# Altium schematic sheet AMC_Connector.SchDoc: AMC FMC Carrier v4.0.5
size 420 x 297 mm; DocumentNumber: 1; Revision: 1; SheetNumber: 2; SheetTotal: 29; Organization: ISE; Address1: Warsaw University of Technology; Address2: Nowowiejska 15/19 00-665 Warsaw; Address3: t.przywozki@gmail.com; ModifiedBy: F. Świtakowski; CheckedDate: -; Title2: AMC connector; DivGrp: ISE; Designer: T.Przywozki; Project: AMC FMC Carrier v4.0.5
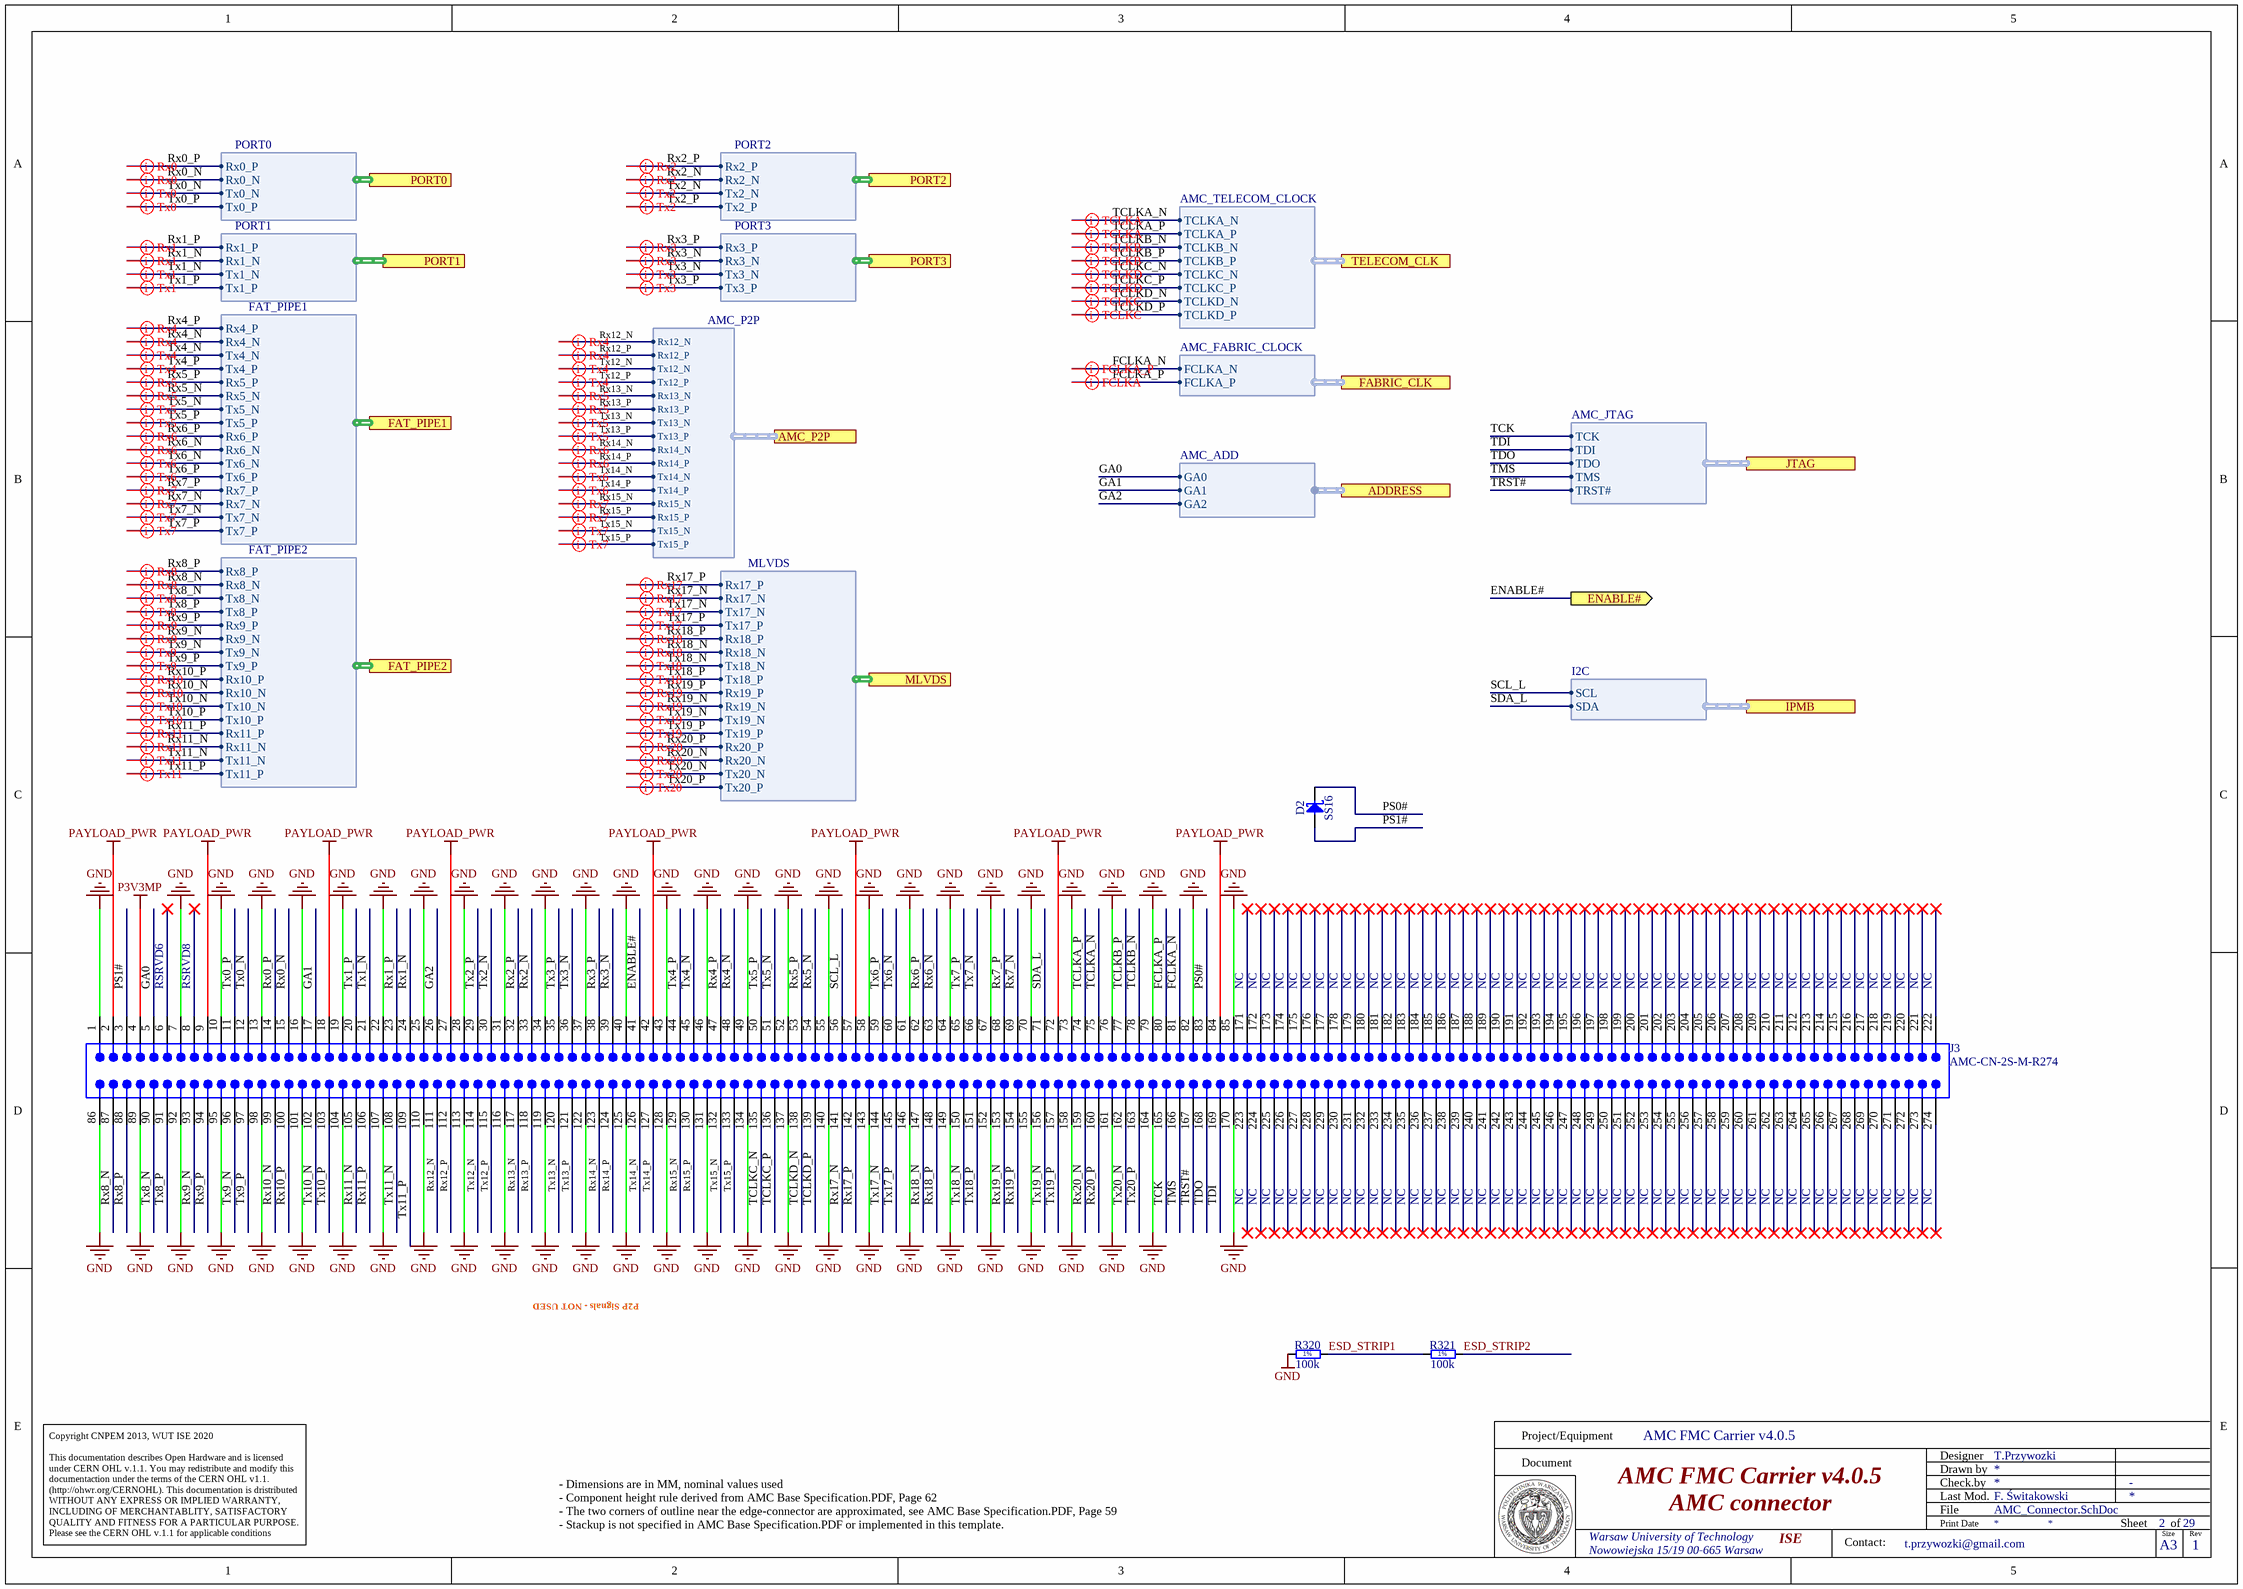
[diagram p0: AMC_Connector.SchDoc]

## Parts
D2  SS16  [DIOM5127X229N]
J3  AMC-CN-2S-M-R274  [AMC-GF-2D-750-O274]  (no BOM)
R320  100k  [RESC3216X65N]
R321  100k  [RESC3216X65N]

## Ports
ADDRESS (harness AMC_ADD), AMC_P2P (harness AMC_P2P), ENABLE# (out), FABRIC_CLK (harness AMC_FABRIC_CLOCK), FAT_PIPE1 (harness FAT_PIPE1), FAT_PIPE2 (harness FAT_PIPE2), IPMB (harness I2C), JTAG (harness AMC_JTAG), MLVDS (harness MLVDS), PORT0 (harness PORT0), PORT1 (harness PORT1), PORT2 (harness PORT2), PORT3 (harness PORT3), TELECOM_CLK (harness AMC_TELECOM_CLOCK)

## Harnesses
AMC_JTAG: TCK, TDI, TDO, TMS, TRST#
AMC_TELECOM_CLOCK: TCLKA_N, TCLKA_P, TCLKB_N, TCLKB_P, TCLKC_N, TCLKC_P, TCLKD_N, TCLKD_P
AMC_FABRIC_CLOCK: FCLKA_N, FCLKA_P
I2C: SCL, SDA
PORT0: Rx0_P, Rx0_N, Tx0_N, Tx0_P
PORT1: Rx1_P, Rx1_N, Tx1_N, Tx1_P
FAT_PIPE1: Rx4_P, Rx4_N, Tx4_N, Tx4_P, Rx5_P, Rx5_N, Tx5_N, Tx5_P, Rx6_P, Rx6_N, Tx6_N, Tx6_P, Rx7_P, Rx7_N, Tx7_N, Tx7_P
FAT_PIPE2: Rx8_P, Rx8_N, Tx8_N, Tx8_P, Rx9_P, Rx9_N, Tx9_N, Tx9_P, Rx10_P, Rx10_N, Tx10_N, Tx10_P, Rx11_P, Rx11_N, Tx11_N, Tx11_P
MLVDS: Rx17_P, Rx17_N, Tx17_N, Tx17_P, Rx18_P, Rx18_N, Tx18_N, Tx18_P, Rx19_P, Rx19_N, Tx19_N, Tx19_P, Rx20_P, Rx20_N, Tx20_N, Tx20_P
PORT2: Rx2_P, Rx2_N, Tx2_N, Tx2_P
PORT3: Rx3_P, Rx3_N, Tx3_N, Tx3_P
AMC_ADD: GA0, GA1, GA2
AMC_P2P: Rx12_N, Rx12_P, Tx12_N, Tx12_P, Rx13_N, Rx13_P, Tx13_N, Tx13_P, Rx14_N, Rx14_P, Tx14_N, Tx14_P, Rx15_N, Rx15_P, Tx15_N, Tx15_P

## Nets
GND: J3.1 J3.7 J3.10 J3.13 J3.16 J3.19 J3.22 J3.25 J3.28 J3.31 J3.34 J3.37 J3.40 J3.43 J3.46 J3.49 J3.52 J3.55 J3.58 J3.61 J3.64 J3.67 J3.70 J3.73 J3.76 J3.79 J3.82 J3.85 J3.86 J3.89 J3.92 J3.95 J3.98 J3.101 J3.104 J3.107 J3.110 J3.113 J3.116 J3.119 J3.122 J3.125 J3.128 J3.131 J3.134 J3.137 J3.140 J3.143 J3.146 J3.149 J3.152 J3.155 J3.158 J3.161 J3.164 J3.170 R320.1
P3V3MP: J3.4
PAYLOAD_PWR: J3.2 J3.9 J3.18 J3.27 J3.42 J3.57 J3.72 J3.84
ENABLE#: J3.41 ; port ENABLE#
ESD_STRIP1: R320.2 R321.1
ESD_STRIP2: R321.2
FCLKA_N: J3.81 ; port FABRIC_CLK.FCLKA_N
FCLKA_P: J3.80 ; port FABRIC_CLK.FCLKA_P
GA0: J3.5 ; port ADDRESS.GA0
GA1: J3.17 ; port ADDRESS.GA1
GA2: J3.26 ; port ADDRESS.GA2
PS0#: D2.1(C) J3.83
PS1#: D2.2(A) J3.3
Rx0_N: J3.15 ; port PORT0.Rx0_N
Rx0_P: J3.14 ; port PORT0.Rx0_P
Rx1_N: J3.24 ; port PORT1.Rx1_N
Rx1_P: J3.23 ; port PORT1.Rx1_P
Rx2_N: J3.33 ; port PORT2.Rx2_N
Rx2_P: J3.32 ; port PORT2.Rx2_P
Rx3_N: J3.39 ; port PORT3.Rx3_N
Rx3_P: J3.38 ; port PORT3.Rx3_P
Rx4_N: J3.48 ; port FAT_PIPE1.Rx4_N
Rx4_P: J3.47 ; port FAT_PIPE1.Rx4_P
Rx5_N: J3.54 ; port FAT_PIPE1.Rx5_N
Rx5_P: J3.53 ; port FAT_PIPE1.Rx5_P
Rx6_N: J3.63 ; port FAT_PIPE1.Rx6_N
Rx6_P: J3.62 ; port FAT_PIPE1.Rx6_P
Rx7_N: J3.69 ; port FAT_PIPE1.Rx7_N
Rx7_P: J3.68 ; port FAT_PIPE1.Rx7_P
Rx8_N: J3.87 ; port FAT_PIPE2.Rx8_N
Rx8_P: J3.88 ; port FAT_PIPE2.Rx8_P
Rx9_N: J3.93 ; port FAT_PIPE2.Rx9_N
Rx9_P: J3.94 ; port FAT_PIPE2.Rx9_P
Rx10_N: J3.99 ; port FAT_PIPE2.Rx10_N
Rx10_P: J3.100 ; port FAT_PIPE2.Rx10_P
Rx11_N: J3.105 ; port FAT_PIPE2.Rx11_N
Rx11_P: J3.106 ; port FAT_PIPE2.Rx11_P
Rx12_N: J3.111 ; port AMC_P2P.Rx12_N
Rx12_P: J3.112 ; port AMC_P2P.Rx12_P
Rx13_N: J3.117 ; port AMC_P2P.Rx13_N
Rx13_P: J3.118 ; port AMC_P2P.Rx13_P
Rx14_N: J3.123 ; port AMC_P2P.Rx14_N
Rx14_P: J3.124 ; port AMC_P2P.Rx14_P
Rx15_N: J3.129 ; port AMC_P2P.Rx15_N
Rx15_P: J3.130 ; port AMC_P2P.Rx15_P
Rx17_N: J3.141 ; port MLVDS.Rx17_N
Rx17_P: J3.142 ; port MLVDS.Rx17_P
Rx18_N: J3.147 ; port MLVDS.Rx18_N
Rx18_P: J3.148 ; port MLVDS.Rx18_P
Rx19_N: J3.153 ; port MLVDS.Rx19_N
Rx19_P: J3.154 ; port MLVDS.Rx19_P
Rx20_N: J3.159 ; port MLVDS.Rx20_N
Rx20_P: J3.160 ; port MLVDS.Rx20_P
SCL_L: J3.56 ; port IPMB.SCL
SDA_L: J3.71 ; port IPMB.SDA
TCK: J3.165 ; port JTAG.TCK
TCLKA_N: J3.75 ; port TELECOM_CLK.TCLKA_N
TCLKA_P: J3.74 ; port TELECOM_CLK.TCLKA_P
TCLKB_N: J3.78 ; port TELECOM_CLK.TCLKB_N
TCLKB_P: J3.77 ; port TELECOM_CLK.TCLKB_P
TCLKC_N: J3.135 ; port TELECOM_CLK.TCLKC_N
TCLKC_P: J3.136 ; port TELECOM_CLK.TCLKC_P
TCLKD_N: J3.138 ; port TELECOM_CLK.TCLKD_N
TCLKD_P: J3.139 ; port TELECOM_CLK.TCLKD_P
TDI: J3.169 ; port JTAG.TDI
TDO: J3.168 ; port JTAG.TDO
TMS: J3.166 ; port JTAG.TMS
TRST#: J3.167 ; port JTAG.TRST#
Tx0_N: J3.12 ; port PORT0.Tx0_N
Tx0_P: J3.11 ; port PORT0.Tx0_P
Tx1_N: J3.21 ; port PORT1.Tx1_N
Tx1_P: J3.20 ; port PORT1.Tx1_P
Tx2_N: J3.30 ; port PORT2.Tx2_N
Tx2_P: J3.29 ; port PORT2.Tx2_P
Tx3_N: J3.36 ; port PORT3.Tx3_N
Tx3_P: J3.35 ; port PORT3.Tx3_P
Tx4_N: J3.45 ; port FAT_PIPE1.Tx4_N
Tx4_P: J3.44 ; port FAT_PIPE1.Tx4_P
Tx5_N: J3.51 ; port FAT_PIPE1.Tx5_N
Tx5_P: J3.50 ; port FAT_PIPE1.Tx5_P
Tx6_N: J3.60 ; port FAT_PIPE1.Tx6_N
Tx6_P: J3.59 ; port FAT_PIPE1.Tx6_P
Tx7_N: J3.66 ; port FAT_PIPE1.Tx7_N
Tx7_P: J3.65 ; port FAT_PIPE1.Tx7_P
Tx8_N: J3.90 ; port FAT_PIPE2.Tx8_N
Tx8_P: J3.91 ; port FAT_PIPE2.Tx8_P
Tx9_N: J3.96 ; port FAT_PIPE2.Tx9_N
Tx9_P: J3.97 ; port FAT_PIPE2.Tx9_P
Tx10_N: J3.102 ; port FAT_PIPE2.Tx10_N
Tx10_P: J3.103 ; port FAT_PIPE2.Tx10_P
Tx11_N: J3.108 ; port FAT_PIPE2.Tx11_N
Tx11_P: J3.109 ; port FAT_PIPE2.Tx11_P
Tx12_N: J3.114 ; port AMC_P2P.Tx12_N
Tx12_P: J3.115 ; port AMC_P2P.Tx12_P
Tx13_N: J3.120 ; port AMC_P2P.Tx13_N
Tx13_P: J3.121 ; port AMC_P2P.Tx13_P
Tx14_N: J3.126 ; port AMC_P2P.Tx14_N
Tx14_P: J3.127 ; port AMC_P2P.Tx14_P
Tx15_N: J3.132 ; port AMC_P2P.Tx15_N
Tx15_P: J3.133 ; port AMC_P2P.Tx15_P
Tx17_N: J3.144 ; port MLVDS.Tx17_N
Tx17_P: J3.145 ; port MLVDS.Tx17_P
Tx18_N: J3.150 ; port MLVDS.Tx18_N
Tx18_P: J3.151 ; port MLVDS.Tx18_P
Tx19_N: J3.156 ; port MLVDS.Tx19_N
Tx19_P: J3.157 ; port MLVDS.Tx19_P
Tx20_N: J3.162 ; port MLVDS.Tx20_N
Tx20_P: J3.163 ; port MLVDS.Tx20_P

Not connected (* = marked no-connect by the designer): J3 6* 8* 171* 172* 173* 174* 175* 176* 177* 178* 179* 180* 181* 182* 183* 184* 185* 186* 187* 188* 189* 190* 191* 192* 193* 194* 195* 196* 197* 198* 199* 200* 201* 202* 203* 204* 205* 206* 207* 208* 209* 210* 211* 212* 213* 214* 215* 216* 217* 218* 219* 220* 221* 222* 223* 224* 225* 226* 227* 228* 229* 230* 231* 232* 233* 234* 235* 236* 237* 238* 239* 240* 241* 242* 243* 244* 245* 246* 247* 248* 249* 250* 251* 252* 253* 254* 255* 256* 257* 258* 259* 260* 261* 262* 263* 264* 265* 266* 267* 268* 269* 270* 271* 272* 273* 274*

## Layout directives
differential pair: FCLKA_N, FCLKA_P, Rx0_N, Rx0_P, Rx1_N, Rx1_P, Rx2_N, Rx2_P, Rx3_N, Rx3_P, Rx4_N, Rx4_P, Rx5_N, Rx5_P, Rx6_N, Rx6_P, Rx7_N, Rx7_P, Rx8_N, Rx8_P, Rx9_N, Rx9_P, Rx10_N, Rx10_P, Rx11_N, Rx11_P, Rx12_N, Rx12_P, Rx13_N, Rx13_P, Rx14_N, Rx14_P, Rx15_N, Rx15_P, Rx17_N, Rx17_P, Rx18_N, Rx18_P, Rx19_N, Rx19_P, Rx20_N, Rx20_P, TCLKA_N, TCLKA_P, TCLKB_N, TCLKB_P, TCLKC_N, TCLKC_P, TCLKD_N, TCLKD_P, Tx0_N, Tx0_P, Tx1_N, Tx1_P, Tx2_N, Tx2_P, Tx3_N, Tx3_P, Tx4_N, Tx4_P, Tx5_N, Tx5_P, Tx6_N, Tx6_P, Tx7_N, Tx7_P, Tx8_N, Tx8_P, Tx9_N, Tx9_P, Tx10_N, Tx10_P, Tx11_N, Tx11_P, Tx12_N, Tx12_P, Tx13_N, Tx13_P, Tx14_N, Tx14_P, Tx15_N, Tx15_P, Tx17_N, Tx17_P, Tx18_N, Tx18_P, Tx19_N, Tx19_P, Tx20_N, Tx20_P

## Notes on the sheet
- RSRVD6
- RSRVD8
- NC
- P2P Signals - NOT USED
- - Dimensions are in MM, nominal values used
  - Component height rule derived from AMC Base Specification.PDF, Page 62
  - The two corners of outline near the edge-connector are approximated, see AMC Base Specification.PDF, Page 59
  - Stackup is not specified in AMC Base Specification.PDF or implemented in this template.
- Project/Equipment
- Document
- Designer
- Drawn by
- Check.by
- Copyright CNPEM 2013, WUT ISE 2020
  This documentation describes Open Hardware and is licensed under CERN OHL v.1.1. You may redistribute and modify this documentaction under the terms of the CERN OHL v1.1.
  (http://ohwr.org/CERNOHL). This documentation is dristributed WITHOUT ANY EXPRESS OR IMPLIED WARRANTY, INCLUDING OF MERCHANTABLITY, SATISFACTORY QUALITY AND FITNESS FOR A PARTICULAR PURPOSE. Please see the CERN OHL v.1.1 for applicable conditions
- File
- Last Mod.
- Print Date
- Sheet
- Size
- A3
- of
- Rev
- Contact:
- (in symbol R1206_100K_1%_0.25W_100PPM) 1%

## Library data of the parts
D2 = SS16: Schottky Diode; Part Description: Surface Mount Schottky Barrier Rectifier; Manufacturer: VISHAY GENERAL SEMICONDUCTOR; Voltage: 60V; Power: 1A; Table: Diodes; Part Number: SS16; Component Kind: Standard; Component Type: Standard; Device: SS16; PackageDescription: DO-214-AC Molded Diode, Body 5.1x2.7mm, IPC Medium Density; Manufacturer Part Number: SS16; Pin Count: 2; Case: DO-214AC; Mounted: Yes; Socket: No; SMD: Yes; ComponentHeight: 2.29mm; HelpURL: \\cern.ch\dfs\Applications\Altium\Datasheets\SS16.pdf; Author: CERN DEM JLC; CreateDate: 2008-07-15; LatestRevisionDate: 2010-08-23
J3 = CMP-0001-00058-2: Golden finger, AMC, Dual, Opposite, Pitch 0.75mm, 170-Position; Package Version: rev2.0, Nov-2006; Mating Connector: Molex-0758000001; Datasheet Version: rev2.0, Nov-2006; ClassName: Edge Connector; Package Reference: AMC-GF-2D-750-O274; Publisher: Altium
R320 R321 = R1206_100K_1%_0.25W_100PPM: Resistor - 1%; Part Description: General Purpose Thick Film Chip Resistor; Manufacturer: GENERIC; Manufacturer1 Part Number: NRC12F1003TRF; Power: 0.25W; TC: ±100ppm/°C; Table: Resistors SMD; Part Number: R1206_100K_1%_0.25W_100PPM; Component Kind: Standard; Component Type: Standard; Pin Count: 2; Value: 100k; Status: Preferred; Tolerance: ±1%; Manufacturer Part Number: R1206_100K_1%_0.25W_100PPM; Case: 1206; Mounted: Yes; Socket: No; SMD: Yes; Manufacturer1 Example: NIC COMPONENT; Manufacturer1 ComponentHeight: 0.65mm; HelpURL: \\cern.ch\dfs\Applications\Altium\Datasheets\R1206_NIC_NRC.pdf; Author: CERN DEM JLC; CreateDate: 2007-12-03; LatestRevisionDate: 2008-03-13